# EAGLE design IMU_adaptator (EAGLE 8.4.1)
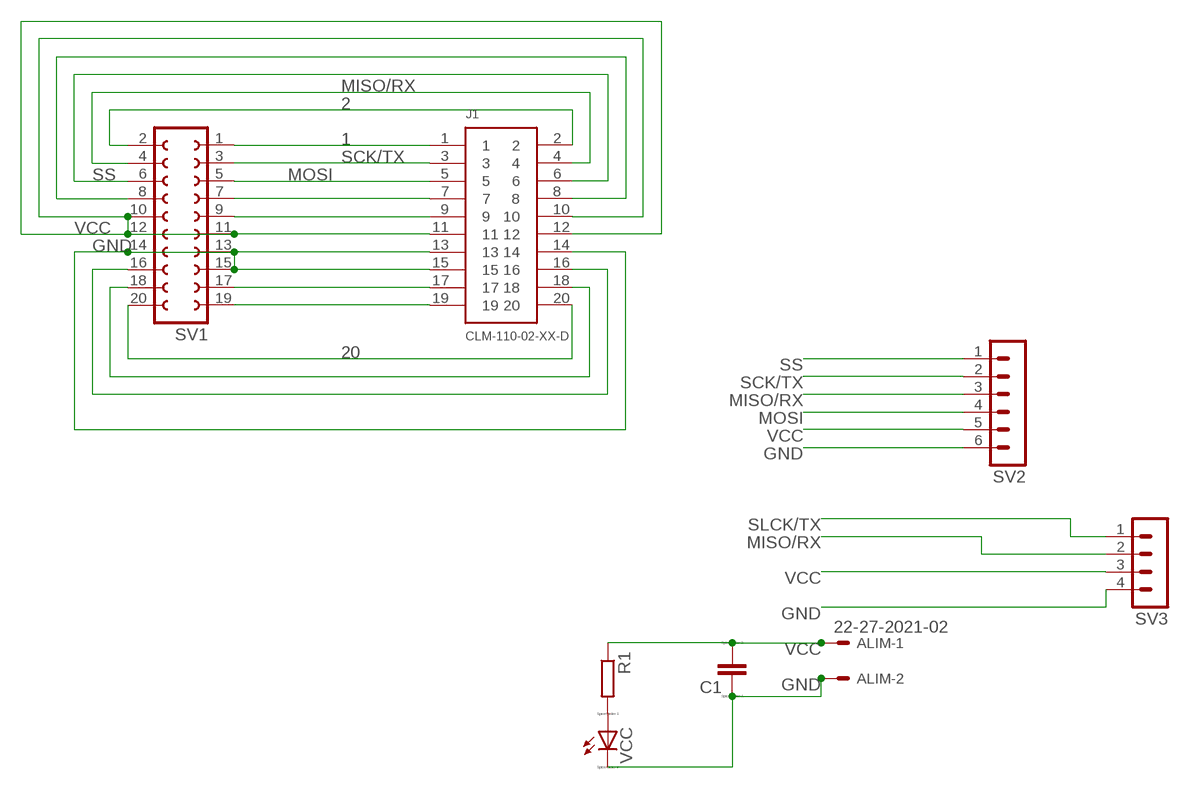
[diagram p0: schematic, sheet 1]

## Parts
ALIM  22-27-2021-02  [6410-02]
C1  C  [C0805]
J1  CLM-110-02-XX-D  [CLM-110-02-XX-D]
R1  R-EU_0204/5  [0204/5]
SV1  FE10-2  [FE10-2]
SV2  MA06-1  [MA06-1]
SV3  MA04-1  [MA04-1]
VCC  LED_ELD260  [LED_LD260]

## Nets
1: J1.1 SV1.1
2: J1.2 SV1.2
20: J1.20 SV1.20
GND: ALIM.2 C1.1 J1.13 J1.14 J1.15 SV1.13 SV1.14 SV1.15 SV2.6 SV3.4 VCC.K(C)
MISO/RX: J1.4 SV1.4 SV2.3 SV3.2
MOSI: J1.5 SV1.5 SV2.4
N$7: R1.2 VCC.A
N$8: J1.7 SV1.7
N$9: J1.9 SV1.9
N$13: J1.17 SV1.17
N$14: J1.19 SV1.19
N$18: J1.8 SV1.8
N$22: J1.18 SV1.18
N$23: J1.16 SV1.16
SCK/TX: J1.3 SV1.3 SV2.2
SLCK/TX: SV3.1
SS: J1.6 SV1.6 SV2.1
VCC: ALIM.1 C1.2 J1.10 J1.11 J1.12 R1.1 SV1.10 SV1.11 SV1.12 SV2.5 SV3.3

## Library data of the parts
ALIM = con-molex:22-?-02: CONNECTOR wire to board 2.54 mm (.1 inch) pitch header; OC_FARNELL: unknown; OC_NEWARK: unknown
C1 = eagle-ltspice:C: CAPACITOR, European symbol; SPICEMODEL: NONE; SPICEPREFIX: C
J1 = CLM-110-02-XX-D:CLM-110-02-XX-D: LOW PROFILE 1MMX1MM DOUBLE ROW BODY. MANUFACTURER:SAMTEC.
R1 = rcl:R-EU_: RESISTOR, European symbol
SV1 = con-lsta:FE10-2: FEMALE HEADER; OC_FARNELL: unknown; OC_NEWARK: unknown
SV2 = con-lstb:MA06-1: PIN HEADER; OC_FARNELL: unknown; OC_NEWARK: unknown
SV3 = con-lstb:MA04-1: PIN HEADER; OC_FARNELL: unknown; OC_NEWARK: unknown
VCC = eagle-ltspice:LED_E: LED Source: http://www.osram.convergy.de Source: www.luxeon.com Source: www.kingbright.com; SPICEMODEL: NONE; SPICEPREFIX: D; SPICETYPE: diode

## Board
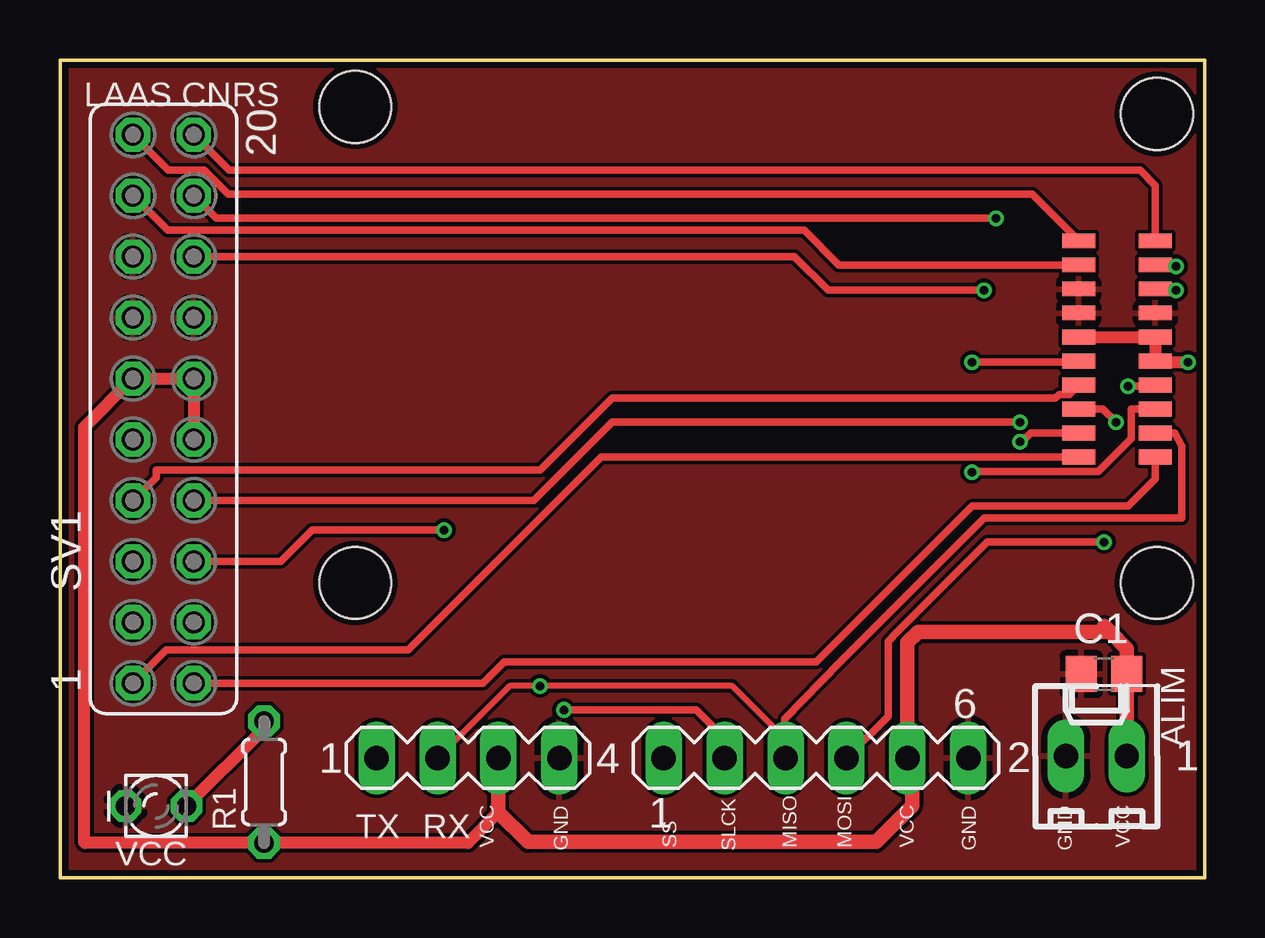
[diagram p1: board, top side]
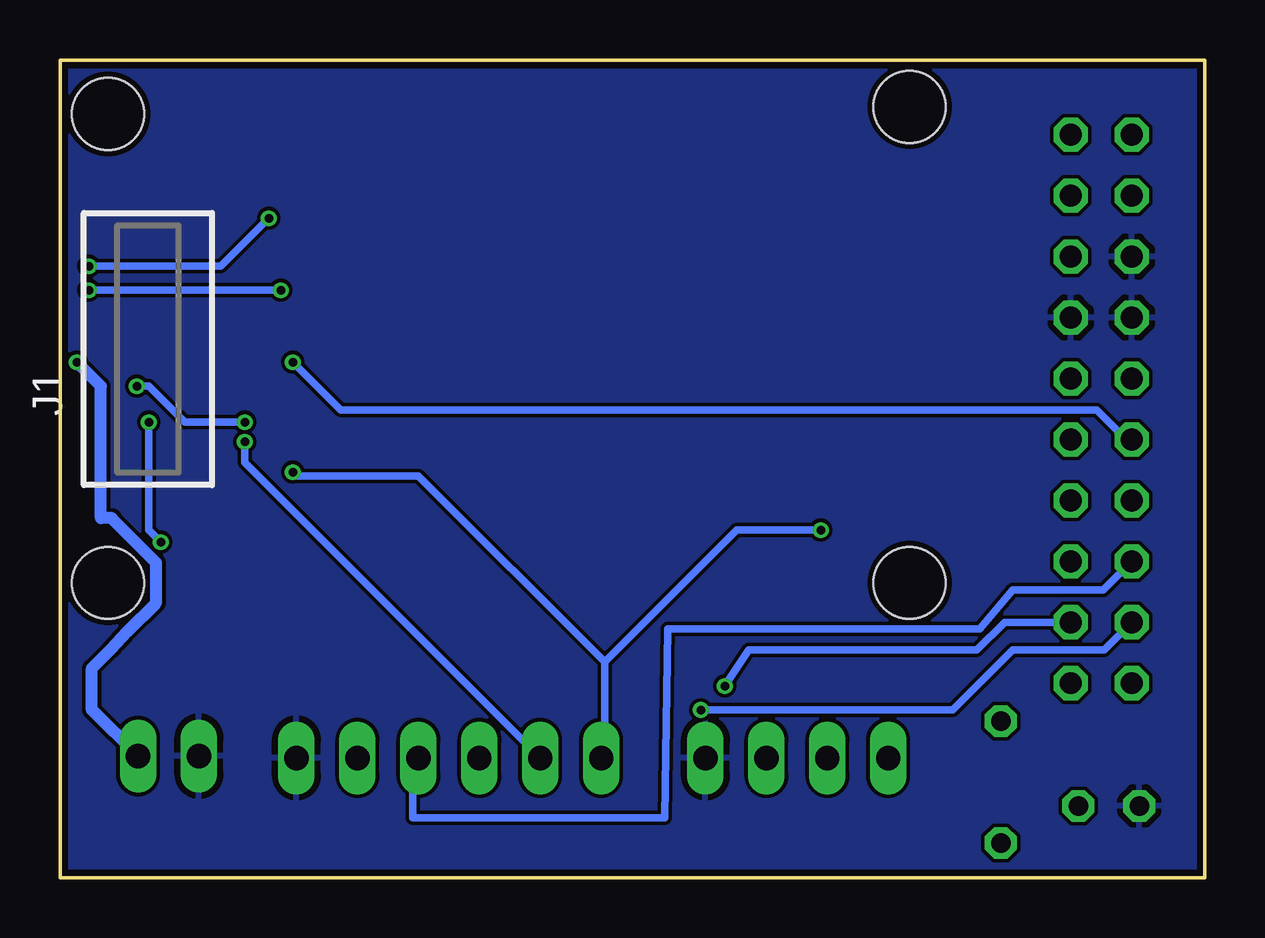
[diagram p2: board, bottom side, seen from below]

Size 47.7 x 34.1 mm. Coordinates in mm from the lower left corner, seen from the top.
Outline: 0,0 47.7,0 47.7,34.1 0,34.1 0,0
Copper layers (1*16): Top 0.035mm / dielectric 1.5mm / Bottom 0.035mm
Design rules "SeeedStudio_2layer_DRU_no_angle_20140221": minimum track width 6mil, minimum drill 12mil, track to track 6mil, track to pad 6mil, pad to pad 6mil, via to via 6mil, smd to smd 0mil, copper to edge 10mil, drill to drill 10mil, minimum pad ring 10mil, minimum via ring 6mil, stop-mask expansion 2mil, vias tented up to drill 100mil, thermal gap 10mil
Holes 3 mm at 12.3,32.15 12.3,12.3 45.7,12.3 45.7,31.85

### Footprints (pad centres in the part's own frame; a part is rotated, then mirrored left to right if it is on the bottom)
6410-02 = drill 1.016 long: 1 1.27,0; 2 -1.27,0
C0805 = smd 1.3 x 1.5: 1 -0.95,0; 2 0.95,0
CLM-110-02-XX-D = smd 0.61 x 1.372 bottom: 1 -4.503,-1.6; 2 -4.503,1.6; 3 -3.503,-1.6; 4 -3.503,1.6; 5 -2.502,-1.6; 6 -2.502,1.6; 7 -1.501,-1.6; 8 -1.501,1.6; 9 -0.5,-1.6; 10 -0.5,1.6; 11 0.5,-1.6; 12 0.5,1.6; 13 1.501,-1.6; 14 1.501,1.6; 15 2.502,-1.6; 16 2.502,1.6; 17 3.503,-1.6; 18 3.503,1.6; 19 4.503,-1.6; 20 4.503,1.6
0204/5 = drill 0.813 octagon: 1 -2.54,0; 2 2.54,0
FE10-2 = drill 0.914 octagon: 1 -11.43,1.27; 2 -11.43,-1.27; 3 -8.89,1.27; 4 -8.89,-1.27; 5 -6.35,1.27; 6 -6.35,-1.27; 7 -3.81,1.27; 8 -3.81,-1.27; 9 -1.27,1.27; 10 -1.27,-1.27; 11 1.27,1.27; 12 1.27,-1.27; 13 3.81,1.27; 14 3.81,-1.27; 15 6.35,1.27; 16 6.35,-1.27; 17 8.89,1.27; 18 8.89,-1.27; 19 11.43,1.27; 20 11.43,-1.27
MA06-1 = drill 1.016 long: 1 -6.35,0; 2 -3.81,0; 3 -1.27,0; 4 1.27,0; 5 3.81,0; 6 6.35,0
MA04-1 = drill 1.016 long: 1 -3.81,0; 2 -1.27,0; 3 1.27,0; 4 3.81,0
LED_LD260 = drill 0.813 octagon: A -1.27,0; K 1.27,0

### Placement (x,y rotation side)
ALIM  43.18,5.08 0 top
C1  43.5,8.5 0 top
J1  44.04,22.05 90 bottom
R1  8.5,4 90 top
SV1  4.31,19.55 90 top
SV2  31.5,5 0 top
SV3  17,5 0 top
VCC  4,3 180 top

### Tracks (layer width: path | path; a pad name or v marks a point on that pad's centre or on a via)
1
  Top 0.305: J1.1 22.55,17.55 14.5,9.5 4.42,9.5 SV1.1
2
  Top 0.305: SV1.2 7.5,8.12 | 7.5,8.12 7.74,8.12 | 7.5,8.12 17.62,8.12 18.5,9 31.5,9 38,15.5 44.5,15.5 45.64,16.64 J1.2
20
  Top 0.305: SV1.20 7.06,29.5 45,29.5 45.64,28.86 J1.20
GND
  pour Top: 0.2,33.91 47.51,33.91 47.51,32.75 47.51,0.21 0.25,0.21 0.2,0.21
  pour Bottom: 0.4,0.35 47.48,0.35 47.48,0.69 47.48,33.83 46.35,33.83 0.3,33.83 0.3,33.65 0.3,0.36 0.36,0.36 0.36,0.34
MISO/RX  (via drill 0.35)
  Top 0.254: SV2.3 30.23,5.77 28,8 v20,8 18.73,8 SV3.2
  Top 0.305: SV2.3 30.21,6.63 32.5,9 38.5,15 46.75,15 46.75,18 46.45,18.55 J1.4
  Bottom 0.305: SV1.4 8.34,10.66 9.5,9.5 19,9.5 v20,8
MOSI  (via drill 0.35)
  Top 0.305: SV2.4 34.5,6.73 34.5,9.85 34.7,10.05 34.7,10.06 38.64,14 v43.5,14 | v44,19 43.45,19.55 J1.5
  Bottom 0.305: SV1.5 4.24,12 8,12 9.37,10.38 22.37,10.38 22.5,2.5 33,2.5 33,4.77 SV2.4 | v43.5,14 44,14.5 v44,19
N$7
  Top 0.508: VCC.A 8.5,6.23 R1.2
N$8
  Top 0.305: SV1.7 4,16.7 4,17 20,17 23,20 41.47,20 41.63,20.16 42.05,20.16 J1.7
N$9  (via drill 0.35)
  Top 0.305: v38,21.5 42.39,21.5 J1.9
  Bottom 0.305: SV1.9 3.28,18.28 4.5,19.5 36,19.5 v38,21.5
N$13
  Top 0.305: SV1.17 4.48,27 31,27 32.45,25.55 J1.17
N$14
  Top 0.305: SV1.19 4.52,29.5 6,29.5 7,28.5 40.5,28.5 J1.19
N$18  (via drill 0.35)
  Top 0.305: SV1.8 19.74,15.74 23,19 v40,19 | v44.5,20.5 45.59,20.5 J1.8
  Bottom 0.305: v40,19 42.5,19 44,20.5 v44.5,20.5
N$22  (via drill 0.35)
  Top 0.305: SV1.18 6.52,27.5 v39,27.5 | v46.5,25.5 46.45,25.55 J1.18
  Bottom 0.305: v39,27.5 41,25.5 v46.5,25.5
N$23  (via drill 0.35)
  Top 0.305: SV1.16 30.6,25.9 32,24.5 v38.5,24.5 | v46.5,24.5 45.69,24.5 J1.16
  Bottom 0.305: v38.5,24.5 v46.5,24.5
SCK/TX  (via drill 0.35)
  Top 0.305: v40,18.18 40.19,18.37 40.26,18.37 40.44,18.55 J1.3 | v21,7 26.5,7 27.69,5.81 SV2.2
  Bottom 0.305: SV2.2 40,17.31 v40,18.18 | SV1.3 4.2,9.5 8,9.5 10.5,7 v21,7
SS  (via drill 0.35)
  Top 0.305: SV1.6 9.2,13.2 10.5,14.5 v16,14.5 | J1.6 44.63,19.55 44.63,18.32 43.25,16.94 38.02,16.94 v38,16.91
  Bottom 0.305: v16,14.5 19.5,14.5 25,9 | 25,9 25,5.15 SV2.1 | 25,9 32.76,16.76 37.97,16.76 38,16.79 v38,16.91
VCC  (via drill 0.35)
  Top 0.152: C1.2 44.45,9.55
  Top 0.508: 18.27,2.73 17,1.46 R1.1 1.04,1.46 1,1.5 1,18.78 SV1.11 SV1.12 SV1.10 | J1.11 J1.12 J1.10 45.69,21.5 v47,21.5
  Top 0.61: ALIM.1 44.45,9.55 43.75,10.25 | 43.75,10.25 43.5,10.5 | 43.75,10.25 35.75,10.25 35.31,9.81 SV2.5 35.5,4.81 35.5,3 34,1.5 19.5,1.5 18.27,2.73 SV3.3
  Bottom 0.508: v47,21.5 46,20.5 46,15 45.53,15 45.53,14.97 43.69,13.13 43.69,11.47 44.87,10.29 45.58,9.53 46.37,8.74 46.37,7 ALIM.1 43.94,5.59

### Text on the board
tNames: LAAS CNRS | TX | RX | VCC | GND | SS | SLCK | MISO | MOSI | VCC | GND | GND | VCC
tTest: 1